# Altium schematic sheet LE LNA.SchDoc
size A; SheetNumber: 6; SheetTotal: 11
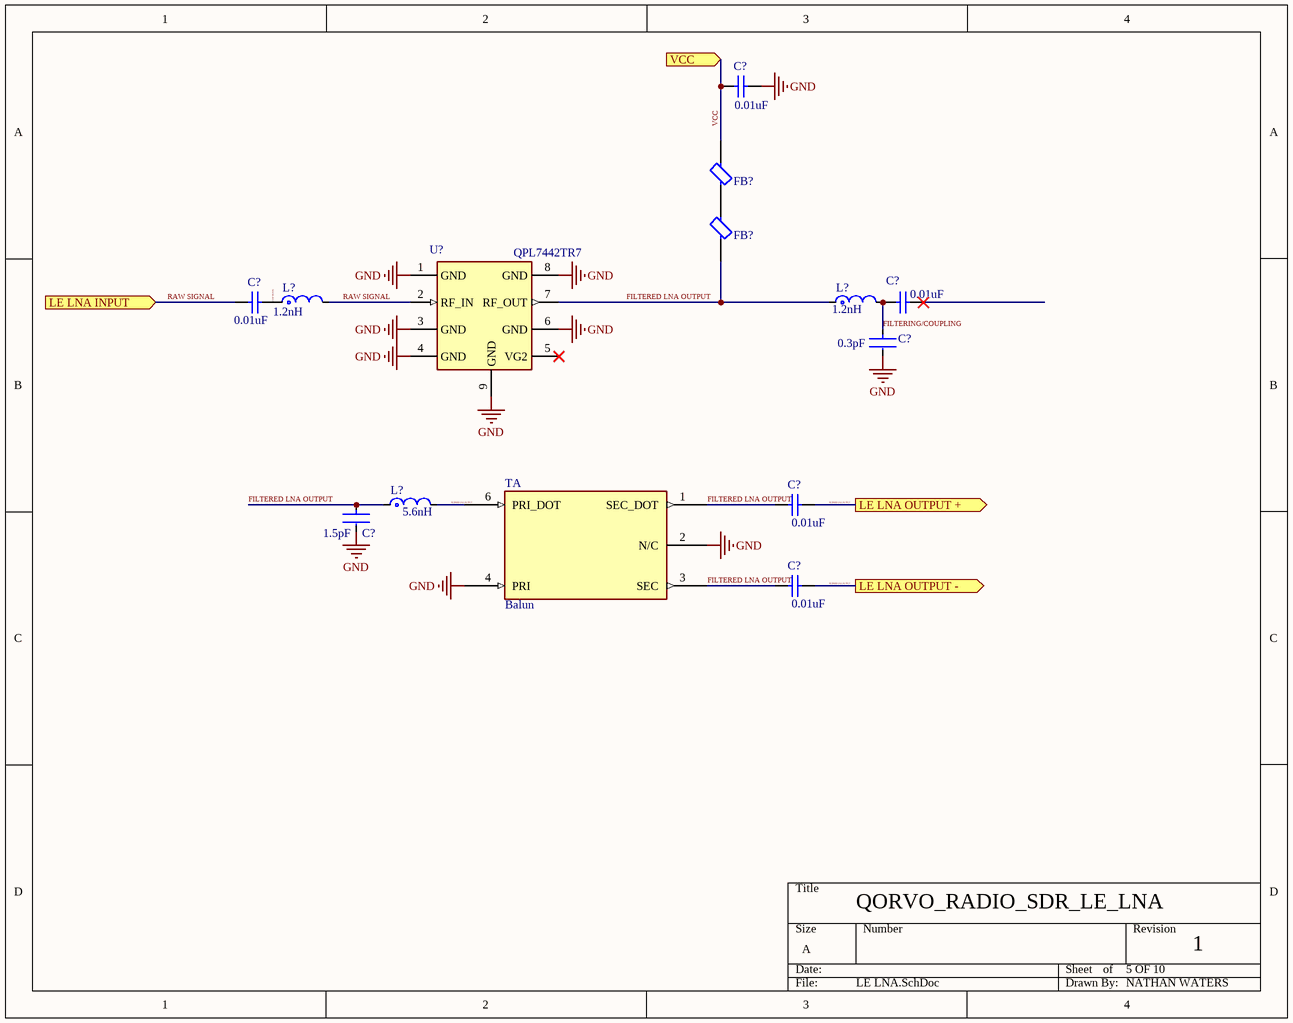
[diagram p0: LE LNA.SchDoc]

## Parts
(Parts that share a designator on the sheet are numbered #1, #2 ... from top to bottom, then left to right.)
C?#1  Capacitance: 0.01uF  [0402 CAP_INDUCTOR]  (hidden comment: GRM155R71C103KA01D)
C?#2  Capacitance: 0.01uF  [CAPC1005X55X25LL05T10]  (hidden comment: GRM155R71C103KA01D)
C?#3  Capacitance: 0.01uF  [CAPC1005X55X25LL05T10]  (hidden comment: GRM155R71C103KA01D)
C?#4  Capacitance: 0.3pF  [FP-GJM155-0_05-IPC_A]  (hidden comment: GJM1555C1HR30WB01D)
C?#5  Capacitance: 1.5pF  [FP-GJM155-0_05-IPC_C]  (hidden comment: GJM1555C1H1R5BB01D)
C?#6  Capacitance: 0.01uF  [CAPC1005X55X25LL05T10]  (hidden comment: GRM155R71C103KA01D)
C?#7  Capacitance: 0.01uF  [CAPC1005X55X25LL05T10]  (hidden comment: GRM155R71C103KA01D)
FB?#1  MMZ1005A182ET000  [0402 CAP_INDUCTOR]  (value not drawn)
FB?#2  MMZ1005A182ET000  [0402 CAP_INDUCTOR]  (value not drawn)
L?#1  INDUCTANCE: 1.2nH  [FP-LQG15HH_02-IPC_C]  (hidden comment: LQG15HN1N2B02D)
L?#2  INDUCTANCE: 1.2nH  [FP-LQG15HH_02-IPC_C]  (hidden comment: LQG15HN1N2B02D)
L?#3  INDUCTANCE: 5.6nH  [FP-LQG15HH_02-IPC_B]  (hidden comment: LQG15HS5N6B02D)
T  Balun  [TC414]  (part A of 3)
U?  QPL7442TR7  [QPL7442TR7]

## Ports
LE LNA INPUT (in), LE LNA OUTPUT + (out, see LE Mixer[1B]), LE LNA OUTPUT - (out, see LE Mixer[1B]), VCC (in, see 0.9V REG[3B], 3.3v REG[3B], AA[1B], AA[2B], HE LNA[3A], HE Mixer[3C], LE Mixer[3C], LPF[1B], SWITCH[3B])

## Nets
GND: C?#1.2 C?#4.2 C?#5.2 T.2(N/C) T.4(PRI) U?.1(GND) U?.3(GND) U?.4(GND) U?.6(GND) U?.8(GND) U?.9(GND)
FILTERED LNA OUTPUT: C?#5.1 C?#6.1 C?#6.2 C?#7.1 C?#7.2 FB?#2.1 L?#2.1 L?#3.1 L?#3.2 T.1(SEC_DOT) T.3(SEC) T.6(PRI_DOT) U?.7(RF_OUT) ; port LE LNA OUTPUT +, port LE LNA OUTPUT -
FILTERING/COUPLING: C?#3.1 C?#4.1 L?#2.2
RAW SIGNAL: C?#2.1 C?#2.2 L?#1.1 L?#1.2 U?.2(RF_IN) ; port LE LNA INPUT
VCC: C?#1.1 FB?#1.2 ; port VCC

Not connected (* = marked no-connect by the designer): C?#3 2*; FB?#1 1; FB?#2 2; U? 5(VG2)*

## Notes on the sheet
- QORVO_RADIO_SDR_LE_LNA
- 5 OF 10
- 1
- NATHAN WATERS

## Library data of the parts
C?#1 = CAP-NP-2: Chip Capacitor, 10 nF, 16 V, 10%, -55 to 125 degC, 0402 (1005 Metric), RoHS, Tape and Reel; Manufacturer: Murata; Rated Voltage: 16V; Dielectric: X7R; Manufacturer URL: http://www.murata.com/; Package Description: 2-Pin Surface Mount Device, Body 1 x 0.5 mm; Case Size/Dimension: 0402; Tolerance (%): ±10%; Datasheet Version: 06/2016; Package Reference: 0402; Mounting Technology: SurfaceMount; Datasheet URL: http://psearch.en.murata.com/capacitor/product/GRM155R71C103KA01%23.pdf
C?#2 C?#3 C?#6 C?#7 = CMP-2000-06332-1: Chip Capacitor, 10 nF, 16 V, 10%, -55 to 125 degC, 0402 (1005 Metric), RoHS, Tape and Reel; Manufacturer: Murata; Rated Voltage: 16V; Dielectric: X7R; Manufacturer URL: http://www.murata.com/; Package Description: 2-Pin Surface Mount Device, Body 1 x 0.5 mm; Case Size/Dimension: 0402; Tolerance (%): ±10%; Datasheet Version: 06/2016; Package Reference: 0402; Mounting Technology: SurfaceMount; Datasheet URL: http://psearch.en.murata.com/capacitor/product/GRM155R71C103KA01%23.pdf
C?#4 = CMP-2008-03901-2: Multi-Layer Ceramic Capacitor 0.3pF C0G  ±0.05pF 0402 Paper T/R; Voltage Rating (DC): 50V; Packaging: Tape and Reel; Length: 1mm; Min Operating Temperature: -55°C; Case Code (Metric): 1005; Package Quantity: 10000; Termination: SMD/SMT; Height: 0.5mm; Dielectric: C0G; Case Code (Imperial): 0402; Mount: Surface Mount; Max Operating Temperature: 125°C; Thickness: 0.022inch; Radiation Hardening: No; Voltage Rating: 50V; Lead Free: Lead Free; Depth: 0.5mm; Case/Package: 0402; Width: 0.02inch
C?#5 = CMP-2008-03820-2: Multi-Layer Ceramic Capacitor 1.5pF C0G  ±0.1pF 0402 Paper T/R; Temperature Coefficient: 30ppm/°C; Voltage Rating: 50V; Depth: 0.5mm; Case Code (Imperial): 0402; Package Quantity: 10000; Length: 1mm; Number of Pins: 2; Max Operating Temperature: 125°C; Mount: Surface Mount; Construction: Flat; Thickness: 0.022inch; Series: GJM; Packaging: Tape and Reel; Radiation Hardening: No; REACH SVHC: No SVHC; Case/Package: 0402; Lead Free: Lead Free; Voltage Rating (DC): 50V; Min Operating Temperature: -55°C; Dielectric: C0G; Termination: SMD/SMT; Width: 0.5mm; Lead Pitch: 0.3mm; Case Code (Metric): 1005; Voltage: 50V; Height: 0.5mm
FB?#1 FB?#2 = 5f30dd21d616792df468990f7003faa: Signal Line Ferrite Bead 1800Ω @ 100MHz 200mA DCR 2100mΩ SMD 0402; Impedance: 1.8kR; DC Resistance (DCR): 2.2R; Tolerance: 25%; RoHS Compliant: Yes; Case Code (Metric): 1005; Case Code (Imperial): 0402; Mount: Surface Mount; Width: 0.02inch; Lead Free: Lead Free; Package Quantity: 1; Core Material: Ferrite; Case/Package: 0402; Height: 0.022inch; Max DC Current: 200mA; Series: MMZ; Packaging: Tape and Reel; Current Rating: 200mA; Length: 0.039inch
L?#1 L?#2 = CMP-06042-012514-1: Multilayer type RF Inductor 1.2nH ±0.1nH 0.08Ω 1000mA 0402
L?#3 = CMP-06042-011799-1: Multilayer type RF Inductor 5.6nH ±0.1nH 0.18Ω 650mA 0402
T = TC1-1-13M+: ComponentLink1Description: Data Sheet; ComponentLink1URL: https://www.minicircuits.com/pdfs/TC1-1-13M+.pdf; ComponentLink2Description: Manufactuer; ComponentLink2URL: Mini-Circuits; ComponentLink3Description: Part Number; ComponentLink3URL: TC1-1-13M+
U? = QPL7442TR7: LNA; Manufacturer_Name: Qorvo; Manufacturer_Part_Number: QPL7442TR7; Datasheet Link: https://www.qorvo.com/products/d/da007775